# Altium schematic sheet 温湿度闹钟_V1.0.SchDoc
size A2
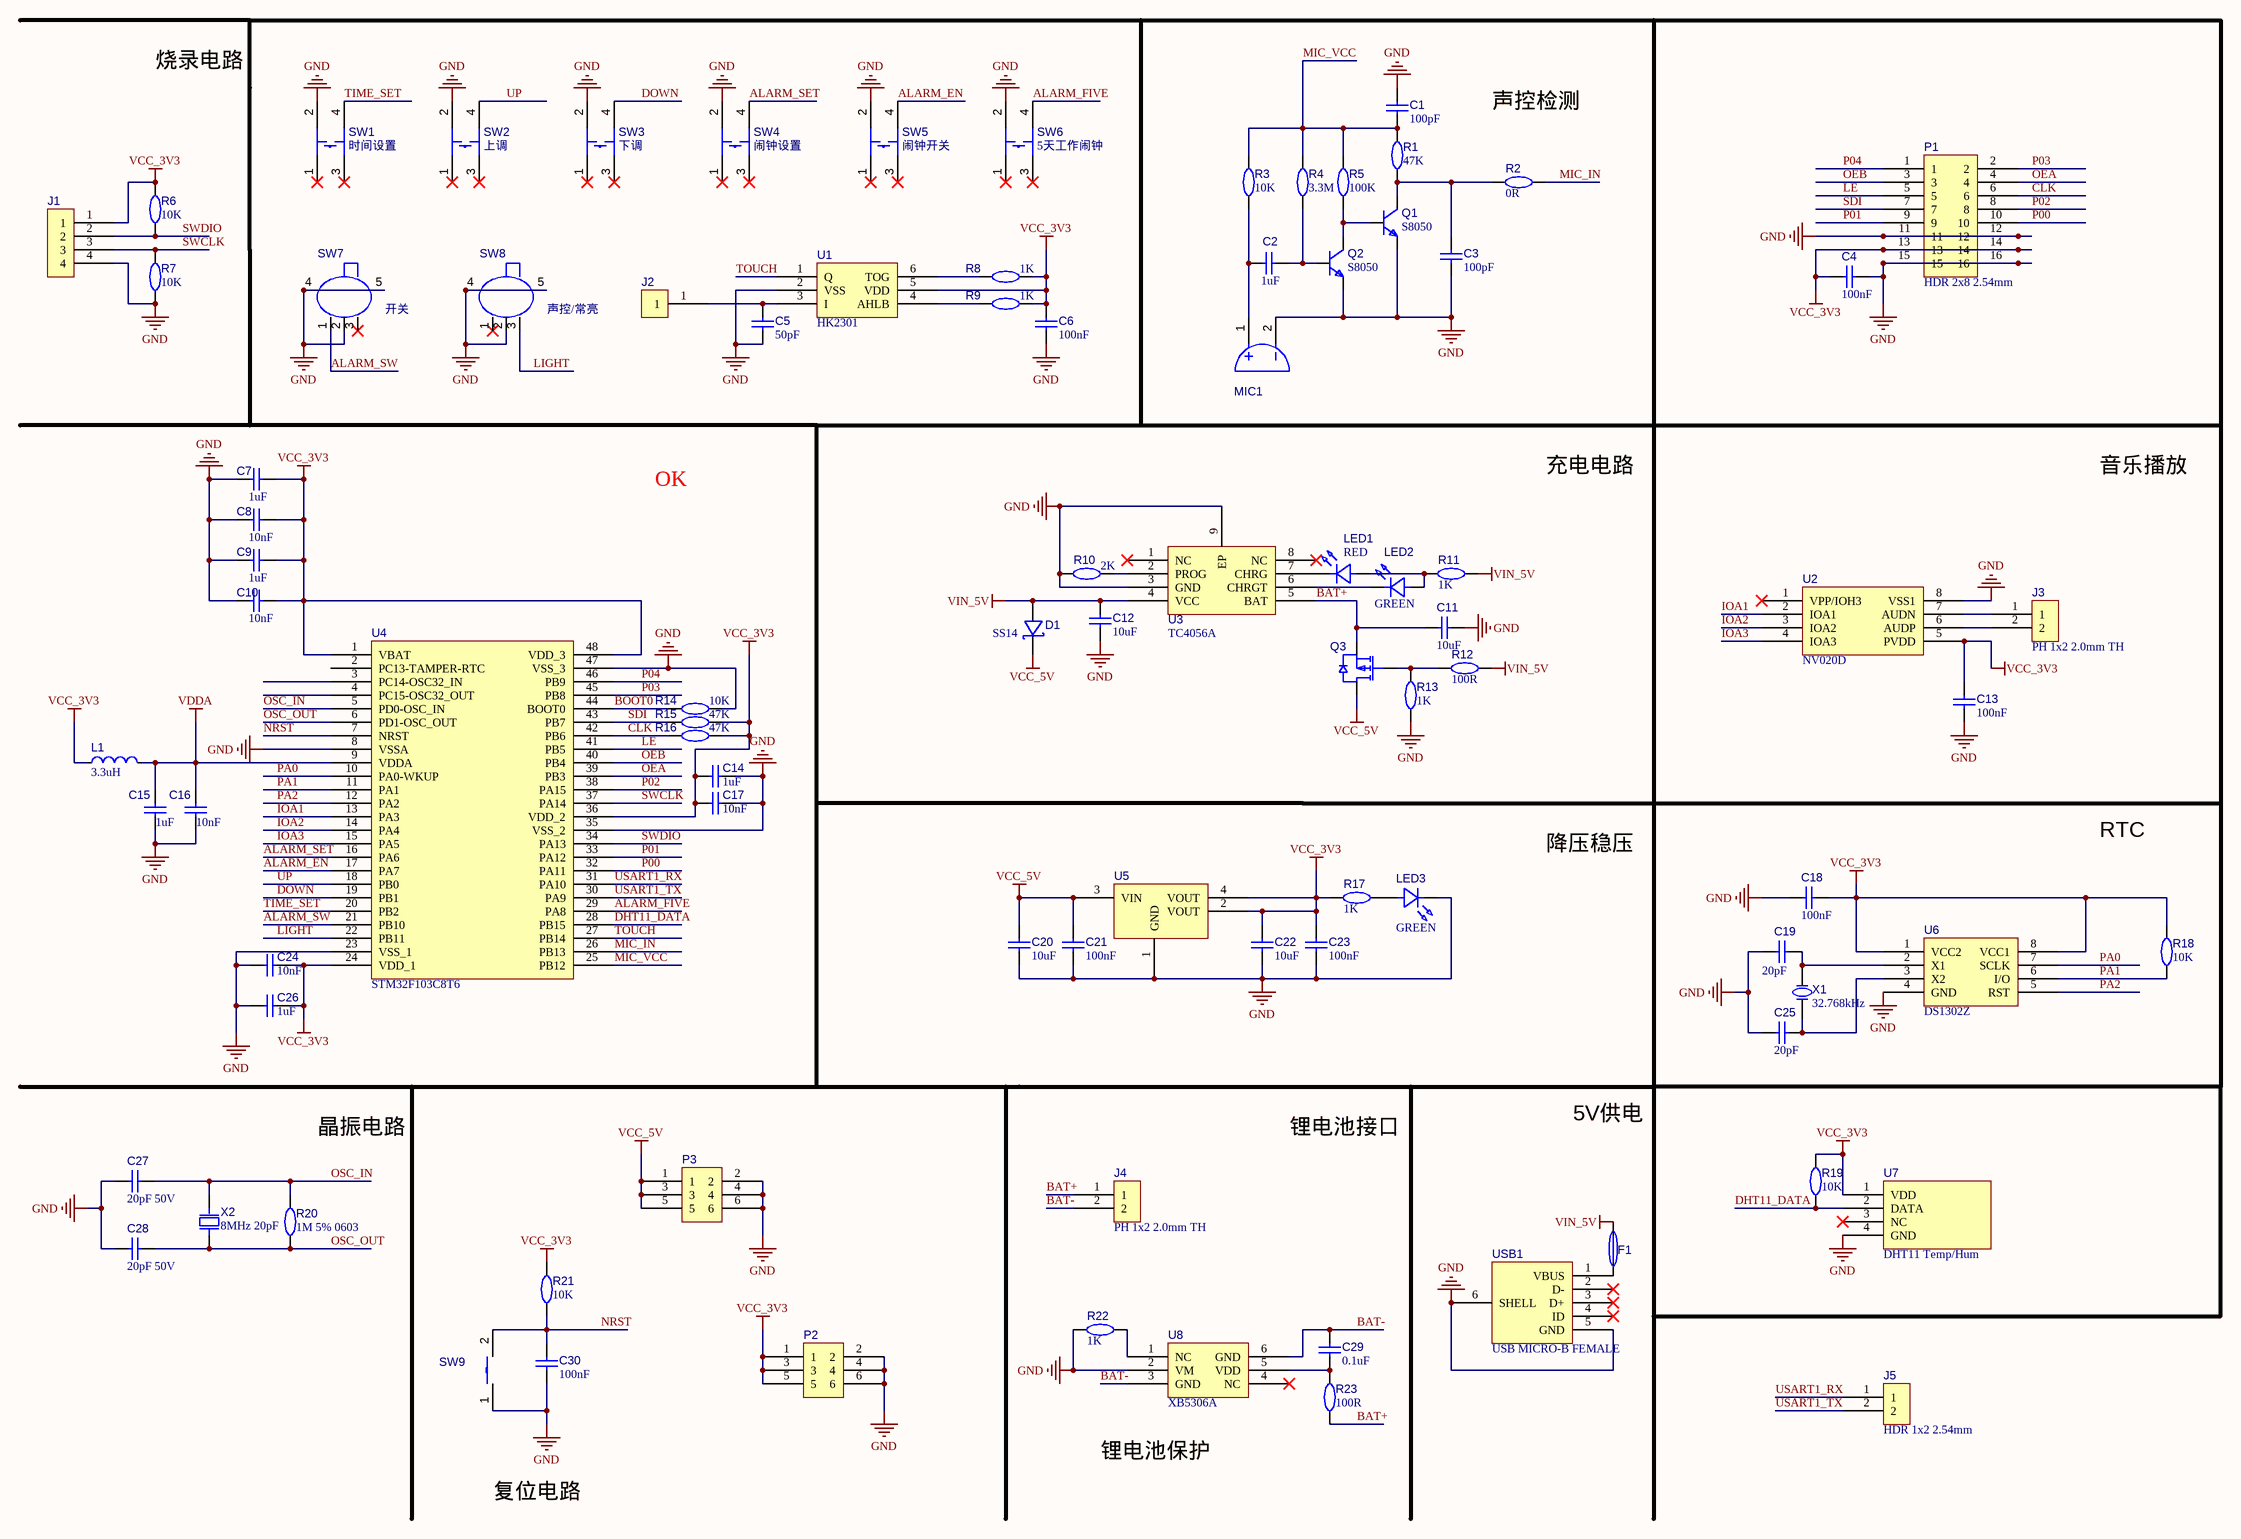
[diagram p0: 温湿度闹钟_V1.0.SchDoc]

## Parts
C1  100pF  [C0603]
C2  1uF  [C0603]
C3  100pF  [C0603]
C4  100nF  [C0603]
C5  50pF  [C0603]
C6  100nF  [C0603]
C7  1uF  [C0603]
C8  10nF  [C0603]
C9  1uF  [C0603]
C10  10nF  [C0603]
C11  10uF  [C0603]
C12  10uF  [C0603]
C13  100nF  [C0603]
C14  1uF  [C0603]
C15  1uF  [C0603]
C16  10nF  [C0603]
C17  10nF  [C0603]
C18  100nF  [C0603]
C19  20pF  [C0603]
C20  10uF  [C0603]
C21  100nF  [C0603]
C22  10uF  [C0603]
C23  100nF  [C0603]
C24  10nF  [C0603]
C25  20pF  [C0603]
C26  1uF  [C0603]
C27  20pF 50V  [C0603]
C28  20pF 50V  [C0603]
C29  0.1uF  [C0603]
C30  100nF  [C0603]
D1  SS14  [SMA_L4.3-W2.6-LS5.2-RD]
F1  PPTC 500mA 13.2V  [F1210]  (value not drawn)
J1  HDR 1x4 2.54mm  [HDR-TH_4P-P2.54-V-M]  (value not drawn)
J2  HDR 1x1 2.54mm  [HDR-TH_1P-P2.54-V-M]  (value not drawn)
J3  PH 1x2 2.0mm TH  [CONN-TH_2P-P2.00_HC-PH-2A-M]
J4  PH 1x2 2.0mm TH  [CONN-TH_2P-P2.00_HC-PH-2A-M]
J5  HDR 1x2 2.54mm  [HDR-TH_2P-P2.54-V-M]
L1  3.3uH  [L0603]
LED1  RED  [LED0603]
LED2  GREEN  [LED0603]
LED3  GREEN  [LED0603]
MIC1  GMI6050P-60DB  [MIC-TH_BD6.0-P1.90-D0.4-L-RD]  (value not drawn)
P1  HDR 2x8 2.54mm  [HDR-TH_16P-P2.54-V-M-R2-C8-S2.54]
P2  HDR 2x3 2.54mm  [HDR-TH_6P-P2.54-V-M-R2-C3-S2.54]  (value not drawn)
P3  HDR 2x3 2.54mm  [HDR-TH_6P-P2.54-V-M-R2-C3-S2.54]  (value not drawn)
Q1  S8050  [SOT-23-3_L2.9-W1.3-P1.90-LS2.3-BR]
Q2  S8050  [SOT-23-3_L2.9-W1.3-P1.90-LS2.3-BR]
Q3  P-MOSFET 30V 4A  [SOT-23_L2.9-W1.3-P1.90-LS2.4-BR]  (value not drawn)
R1  47K  [R0603]
R2  0R  [R0603]
R3  10K  [R0603]
R4  3.3M  [R0603]
R5  100K  [R0603]
R6  10K  [R0603]
R7  10K  [R0603]
R8  1K  [R0603]
R9  1K  [R0603]
R10  2K  [R0603]
R11  1K  [R0603]
R12  100R  [R0603]
R13  1K  [R0603]
R14  10K  [R0603]
R15  47K  [R0603]
R16  47K  [R0603]
R17  1K  [R0603]
R18  10K  [R0603]
R19  10K  [R0603]
R20  1M 5% 0603  [R0603]
R21  10K  [R0603]
R22  1K  [R0603]
R23  100R  [R0603]
SW1  时间设置  [SW-TH_4P-L6.0-W6.0-P4.50-LS6.5]
SW2  上调  [SW-TH_4P-L6.0-W6.0-P4.50-LS6.5]
SW3  下调  [SW-TH_4P-L6.0-W6.0-P4.50-LS6.5]
SW4  闹钟设置  [SW-TH_4P-L6.0-W6.0-P4.50-LS6.5]
SW5  闹钟开关  [SW-TH_4P-L6.0-W6.0-P4.50-LS6.5]
SW6  5天工作闹钟  [SW-TH_4P-L6.0-W6.0-P4.50-LS6.5]
SW7  SW_SS12D07VG4  [SW-TH_SS12D07VG4]  (value not drawn)
SW8  SW_SS12D07VG4  [SW-TH_SS12D07VG4]  (value not drawn)
SW9  TACT 6.0x3.6mm  [SW-SMD_L6.0-W3.3-LS8.0]  (value not drawn)
U1  HK2301  [SOT-23-6_L2.9-W1.6-P0.95-LS2.8-BL]
U2  NV020D  [SOP-8_L4.9-W3.9-P1.27-LS6.0-BL-1]
U3  TC4056A  [ESOP-8_L4.9-W3.9-P1.27-LS6.0-BL-EP]
U4  STM32F103C8T6  [LQFP-48_L7.0-W7.0-P0.50-LS9.0-BL]
U5  LDO 3.3V 1A  [SOT-223-3_L6.5-W3.4-P2.30-LS7.0-BR]  (value not drawn)
U6  DS1302Z  [SOP-8_L4.9-W3.9-P1.27-LS6.0-BL-1]
U7  DHT11 Temp/Hum  [SENSOR-TH_DHT11]
U8  XB5306A  [SOT-23-6_L2.9-W1.6-P0.95-LS2.8-BR]
USB1  USB MICRO-B FEMALE  [MICRO-USB-SMD_MICRO-XNJ-ZB]
X1  32.768kHz  [OSC-TH_BD3.1-P0.8-D0.3]
X2  8MHz 20pF  [OSC-TH_L10.0-W4.5-P5.00]

## Nets
GND: C1.1 C3.2 C4.2 C5.1 C6.1 C7.1 C8.1 C9.1 C10.1 C11.1 C12.1 C13.2 C14.2 C15.1 C16.1 C17.1 C18.1 C19.1 C20.2 C21.2 C22.2 C23.2 C24.2 C25.1 C26.2 C27.1 C28.1 C30.2 J1.4 LED3.1(K) MIC1.2 P1.11 P1.12 P1.15 P1.16 P2.2 P2.4 P2.6 P3.2 P3.4 P3.6 Q1.2(E) Q2.2(E) R7.1 R10.1 R13.1 R14.1 R22.1 SW1.2 SW2.2 SW3.2 SW4.2 SW5.2 SW6.2 SW7.2 SW7.4 SW7.5 SW8.2 SW8.4 SW8.5 SW9.1 U1.2(VSS) U2.8(VSS1) U3.3(GND) U3.9(EP) U4.8(VSSA) U4.23(VSS_1) U4.35(VSS_2) U4.47(VSS_3) U5.1(GND) U6.4(GND) U7.4(GND) U8.2(VM) USB1.5(GND) USB1.6(SHELL)
VCC_3V3: C4.1 C6.2 C7.2 C8.2 C9.2 C10.2 C13.1 C14.1 C17.2 C18.2 C22.1 C23.1 C24.1 C26.1 J1.1 L1.1 P1.13 P1.14 P2.1 P2.3 P2.5 R6.2 R8.2 R9.2 R15.2 R16.2 R17.1 R18.2 R19.2 R21.2 U1.5(VDD) U2.5(PVDD) U4.1(VBAT) U4.24(VDD_1) U4.36(VDD_2) U4.48(VDD_3) U5.2(VOUT) U5.4(VOUT) U6.1(VCC2) U6.8(VCC1) U7.1(VDD)
VCC_5V: C20.1 C21.1 D1.1(K) P3.1 P3.3 P3.5 Q3.3(D) U5.3(VIN)
VDDA: C15.2 C16.2 L1.2 U4.9(VDDA)
VIN_5V: C12.2 D1.2(A) F1.2 R11.2 R12.2 U3.4(VCC)
ALARM_EN: SW5.4 U4.17(PA7)
ALARM_FIVE: SW6.4 U4.29(PA8)
ALARM_SET: SW4.4 U4.16(PA6)
ALARM_SW: SW7.1 U4.21(PB10)
BAT+: C11.2 J4.1 Q3.2(S) R23.1 U3.5(BAT)
BAT-: C29.2 J4.2 U8.3(GND) U8.6(GND)
BOOT0: R14.2 U4.44(BOOT0)
CLK: P1.6 R16.1 U4.42(PB6)
DHT11_DATA: R19.1 U4.28(PB15) U7.2(DATA)
DOWN: SW3.4 U4.19(PB1)
IOA1: U2.2(IOA1) U4.13(PA3)
IOA2: U2.3(IOA2) U4.14(PA4)
IOA3: U2.4(IOA3) U4.15(PA5)
LE: P1.5 U4.41(PB5)
LIGHT: SW8.3 U4.22(PB11)
MIC_IN: R2.1 U4.26(PB13)
MIC_VCC: C1.2 R1.2 R3.2 R4.2 R5.2 U4.25(PB12)
NRST: C30.1 R21.1 SW9.2 U4.7(NRST)
OEA: P1.4 U4.39(PB3)
OEB: P1.3 U4.40(PB4)
OSC_IN: C27.2 R20.2 U4.5(PD0-OSC_IN) X2.1(OSC1)
OSC_OUT: C28.2 R20.1 U4.6(PD1-OSC_OUT) X2.2(OSC2)
P00: P1.10 U4.32(PA11)
P01: P1.9 U4.33(PA12)
P02: P1.8 U4.38(PA15)
P03: P1.2 U4.45(PB8)
P04: P1.1 U4.46(PB9)
PA0: U4.10(PA0-WKUP) U6.7(SCLK)
PA1: R18.1 U4.11(PA1) U6.6(I/O)
PA2: U4.12(PA2) U6.5(RST)
SDI: P1.7 R15.1 U4.43(PB7)
SWCLK: J1.3 R7.2 U4.37(PA14)
SWDIO: J1.2 R6.1 U4.34(PA13)
TIME_SET: SW1.4 U4.20(PB2)
TOUCH: U1.1(Q) U4.27(PB14)
UP: SW2.4 U4.18(PB0)
USART1_RX: J5.1 U4.31(PA10)
USART1_TX: J5.2 U4.30(PA9)
NetC2_1: C2.1 Q2.1(B) R4.1
NetC2_2: C2.2 MIC1.1 R3.1
NetC3_1: C3.1 Q1.3(C) R1.1 R2.2
NetC5_2: C5.2 J2.1 U1.3(I)
NetC19_2: C19.2 U6.2(X1) X1.1(OSC1)
NetC25_2: C25.2 U6.3(X2) X1.2(OSC2)
NetC29_1: C29.1 R23.2 U8.5(VDD)
NetF1_1: F1.1 USB1.1(VBUS)
NetJ3_1: J3.1 U2.7(AUDN)
NetJ3_2: J3.2 U2.6(AUDP)
NetLED1_1: LED1.1(K) U3.7(CHRG)
NetLED1_2: LED1.2(A) LED2.2(A) R11.1
NetLED2_1: LED2.1(K) U3.6(CHRGT)
NetLED3_2: LED3.2(A) R17.2
NetQ1_1: Q1.1(B) Q2.3(C) R5.1
NetQ3_1: Q3.1(G) R12.1 R13.2
NetR8_1: R8.1 U1.6(TOG)
NetR9_1: R9.1 U1.4(AHLB)
NetR10_2: R10.2 U3.2(PROG)
NetR22_2: R22.2 U8.1(NC)

Not connected (* = marked no-connect by the designer): SW1 1* 3*; SW2 1* 3*; SW3 1* 3*; SW4 1* 3*; SW5 1* 3*; SW6 1* 3*; SW7 3*; SW8 1*; U2 1(VPP/IOH3)*; U3 1(NC)* 8(NC)*; U4 2(PC13-TAMPER-RTC) 3(PC14-OSC32_IN) 4(PC15-OSC32_OUT); U7 3(NC)*; U8 4(NC)*; USB1 2(D-)* 3(D+)* 4(ID)*

## Notes on the sheet
- 烧录电路
- 声控检测
- (near SW7) 开关
- (near SW8) 声控/常亮
- OK
- 充电电路
- 音乐播放
- RTC
- 降压稳压
- 晶振电路
- 锂电池接口
- 5V供电
- 复位电路
- 锂电池保护

## Library data of the parts
C1-C18 C20-C24 C26 C29 C30 = CAP_C0603_50V_10nF 50V: 贴片电容; Symbol: CC0603KRX7R9BB103
C19 C25 C27 C28 = CAP_C0603_50V: 贴片电容; Symbol: CC0603JRNPO9BN220
D1 = SS14: 肖特基二极管; Symbol: SS14_C83852
F1 = FUSE_PPTC_500MA_TBD: 保险丝; Symbol: SMD1210P050TF; C: C15997
J1 = HDR_1x04_2.54mm_TH: 直插排针; Symbol: PZ254V-11-04P_C2691448
J2 = HDR_1x01_2.54mm_TH: 直插排针; Symbol: PZ254V-11-01P
J3 J4 = HDR_PH_1x02_2.0mm_TH: 直插线对板针座; Symbol: WAFER-PH2.0-2PZZ
J5 = HDR_1x02_2.54mm_TH: 直插排针; Symbol: PZ254V-11-02P
L1 = L_0603_15MA_3.3uH: 贴片电感; Symbol: CMI160808U3R3KT
LED1-LED3 = LED_RED_20MA_TBD: 发光二极管; Symbol: XL-1608SURC-06
MIC1 = GMI6050P-60DB: 咪头; C: C233951; Symbol: GMI6050P-60DB
P1 = HDR_2x08_2.54mm_TH: 排针; C: C492425
P2 P3 = HDR_2x03_2.54mm_TH: 双排排针; Symbol: PZ254V-12-6P
Q1 Q2 = S8050: 三极管NPN; Symbol: S8050_C20069125; C: C20069125
Q3 = AO3401A: P沟道场效应管; Symbol: AO3401A
R1-R23 = R_0603_100MW: 贴片电阻; Symbol: RC0603JR-071ML
SW1-SW6 = SW_TACT_6x6_7H_TH: 直插轻触开关; Symbol: TS-1002-07026; C: C393938
SW7 SW8 = SW_SS12D07VG4: 滑动开关; Symbol: SS12D07VG4 087; C: C2939726
SW9 = SW_TACT_6036_25H_SMD: 轻触开关; Symbol: TS-1101-C-W
U1 = HK2301: 触摸芯片; C: C5345654; Symbol: HK2301
U2 = NV020D: 音频接口芯片; C: C2928235; Symbol: NV020D
U3 = TC4056A: 锂电池充电芯片; Symbol: TC4056A.; C: C7588528
U5 = AMS1117-3.3: 线性稳压器; Symbol: AMS1117-3.3
U6 = DS1302Z: 实时时钟芯片; C: C2900599; Symbol: DS1302Z
U7 = DHT11: 温湿度传感器; Symbol: DHT11
U8 = XB5306A: 锂电池保护芯片; C: C185105; Symbol: XB5306A
USB1 = CONN_USB_MICRO-B_SMT: Micro-B; Symbol: MICRO XNJ ZB; C: C668587
X1 = XTAL_32.768K_TH: 32.768kHz 直插晶振; Symbol: X308032768KGB2SC
X2 = XTAL_8M_20PF_TH: 直插晶振; Symbol: X49SD8MSD2SC
U4 = STM32F103C8T6: Symbol: STM32F103C8T6